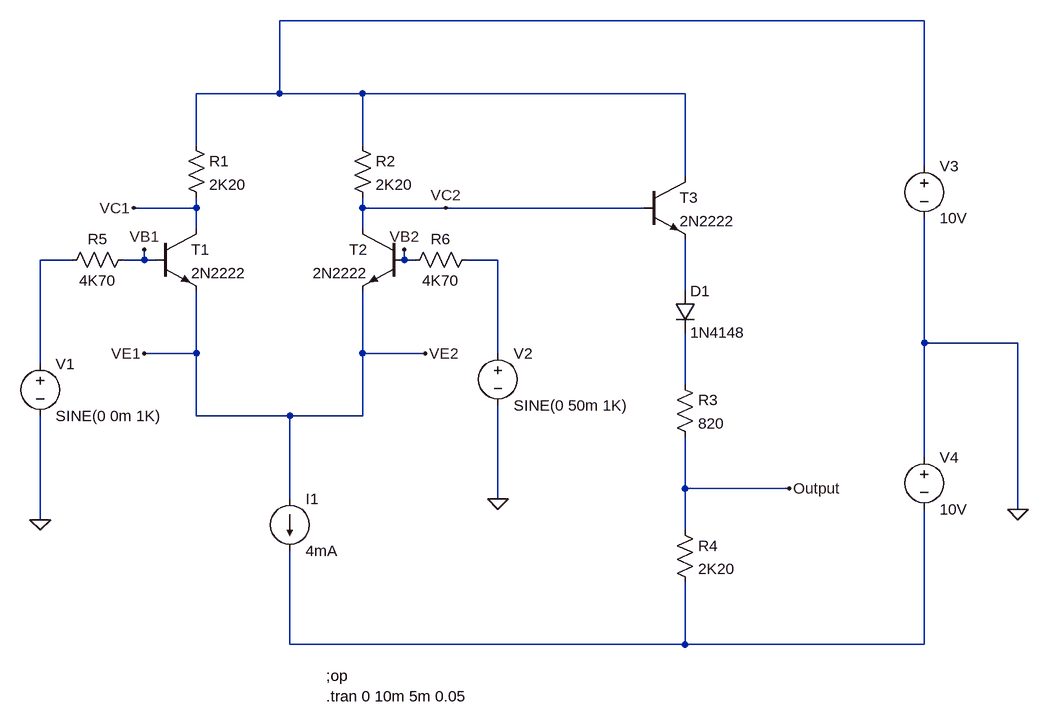
[diagram p0: schematic op_amp_task2.asc]
op_amp_task2.asc, the LTspice schematic file:
Version 4
SHEET 1 1364 992
WIRE 1200 -64 208 -64
WIRE 208 48 208 -64
WIRE 208 48 80 48
WIRE 336 48 208 48
WIRE 832 48 336 48
WIRE 80 128 80 48
WIRE 336 128 336 48
WIRE 1200 160 1200 -64
WIRE 832 176 832 48
WIRE 80 224 80 208
WIRE 80 224 -16 224
WIRE 336 224 336 208
WIRE 464 224 336 224
WIRE 768 224 464 224
WIRE 80 256 80 224
WIRE 336 256 336 224
WIRE -112 304 -160 304
WIRE 0 304 0 288
WIRE 0 304 -32 304
WIRE 16 304 0 304
WIRE 400 304 400 288
WIRE 416 304 400 304
WIRE 544 304 496 304
WIRE 832 352 832 272
WIRE 1200 432 1200 240
WIRE 1344 432 1200 432
WIRE 80 448 80 352
WIRE 80 448 0 448
WIRE 336 448 336 352
WIRE 432 448 336 448
WIRE 544 448 544 304
WIRE -160 464 -160 304
WIRE 832 496 832 416
WIRE 80 544 80 448
WIRE 224 544 80 544
WIRE 336 544 336 448
WIRE 336 544 224 544
WIRE 1200 608 1200 432
WIRE 832 656 832 576
WIRE 992 656 832 656
WIRE 224 672 224 544
WIRE 544 672 544 528
WIRE 1344 688 1344 432
WIRE -160 704 -160 544
WIRE 832 720 832 656
WIRE 224 896 224 752
WIRE 832 896 832 800
WIRE 832 896 224 896
WIRE 1200 896 1200 688
WIRE 1200 896 832 896
FLAG 1344 688 0
FLAG -160 704 0
FLAG 544 672 0
FLAG -16 224 VC1
FLAG 464 224 VC2
FLAG 0 448 VE1
FLAG 0 288 VB1
FLAG 400 288 VB2
FLAG 432 448 VE2
FLAG 992 656 Output
SYMBOL npn 16 256 R0
SYMATTR InstName T1
SYMATTR Value 2N2222
SYMBOL npn 400 256 M0
SYMATTR InstName T2
SYMATTR Value 2N2222
SYMBOL res 64 112 R0
SYMATTR InstName R1
SYMATTR Value 2K20
SYMBOL res 320 112 R0
SYMATTR InstName R2
SYMATTR Value 2K20
SYMBOL res -16 288 R90
WINDOW 0 0 56 VBottom 2
WINDOW 3 32 56 VTop 2
SYMATTR InstName R5
SYMATTR Value 4K70
SYMBOL res 512 288 R90
WINDOW 0 0 56 VBottom 2
WINDOW 3 32 56 VTop 2
SYMATTR InstName R6
SYMATTR Value 4K70
SYMBOL voltage 1200 592 R0
SYMATTR InstName V4
SYMATTR Value 10V
SYMBOL voltage 1200 144 R0
SYMATTR InstName V3
SYMATTR Value 10V
SYMBOL voltage -160 448 R0
WINDOW 123 0 0 Left 0
WINDOW 39 0 0 Left 0
SYMATTR InstName V1
SYMATTR Value SINE(0 0m 1K)
SYMBOL voltage 544 432 R0
WINDOW 123 0 0 Left 0
WINDOW 39 0 0 Left 0
SYMATTR InstName V2
SYMATTR Value SINE(0 50m 1K)
SYMBOL npn 768 176 R0
SYMATTR InstName T3
SYMATTR Value 2N2222
SYMBOL diode 816 352 R0
SYMATTR InstName D1
SYMATTR Value 1N4148
SYMBOL res 816 480 R0
SYMATTR InstName R3
SYMATTR Value 820
SYMBOL res 816 704 R0
SYMATTR InstName R4
SYMATTR Value 2K20
SYMBOL current 224 672 R0
WINDOW 123 0 0 Left 0
WINDOW 39 0 0 Left 0
SYMATTR InstName I1
SYMATTR Value 4mA
TEXT 280 944 Left 2 !;op
TEXT 280 976 Left 2 !.tran 0 10m 5m 0.05

The netlist it stands for:
* op_amp_task2.asc
Q§T1 VC1 VB1 VE2 0 2N2222
Q§T2 VC2 VB2 VE2 0 2N2222
R1 N001 VC1 2K20
R2 N001 VC2 2K20
R5 VB1 N002 4K70
R6 N003 VB2 4K70
V4 0 N006 10V
V3 N001 0 10V
V1 N002 0 SINE(0 0m 1K)
V2 N003 0 SINE(0 50m 1K)
Q§T3 N001 VC2 N004 0 2N2222
D1 N004 N005 1N4148
R3 N005 Output 820
R4 Output N006 2K20
I1 VE2 N006 4mA
.model D D
.lib standard.dio
.model NPN NPN
.model PNP PNP
.lib standard.bjt
;op
.tran 0 10m 5m 0.05
.backanno
.end